# Altium schematic sheet EIS_Main_SensorInterface.SchDoc: Wirless-Power und Sensor-Schnittstellen
size A4; Organization: Hahn-Schickard; Address1: Wilhelm-Schickard-Str. 10; Address2: 78052 Villingen-Schwenningen; Address3: Bernd.Ehrbrecht@Hahn-Schickard.de; DocumentNumber: 1; Revision: 1.0; SheetNumber: 7; SheetTotal: 7; PhoneNumber: 0 7721 943 137; E-Mail: Xxxx.Xxxx@Hahn-Schickard.de; ProjectName: Project File Name
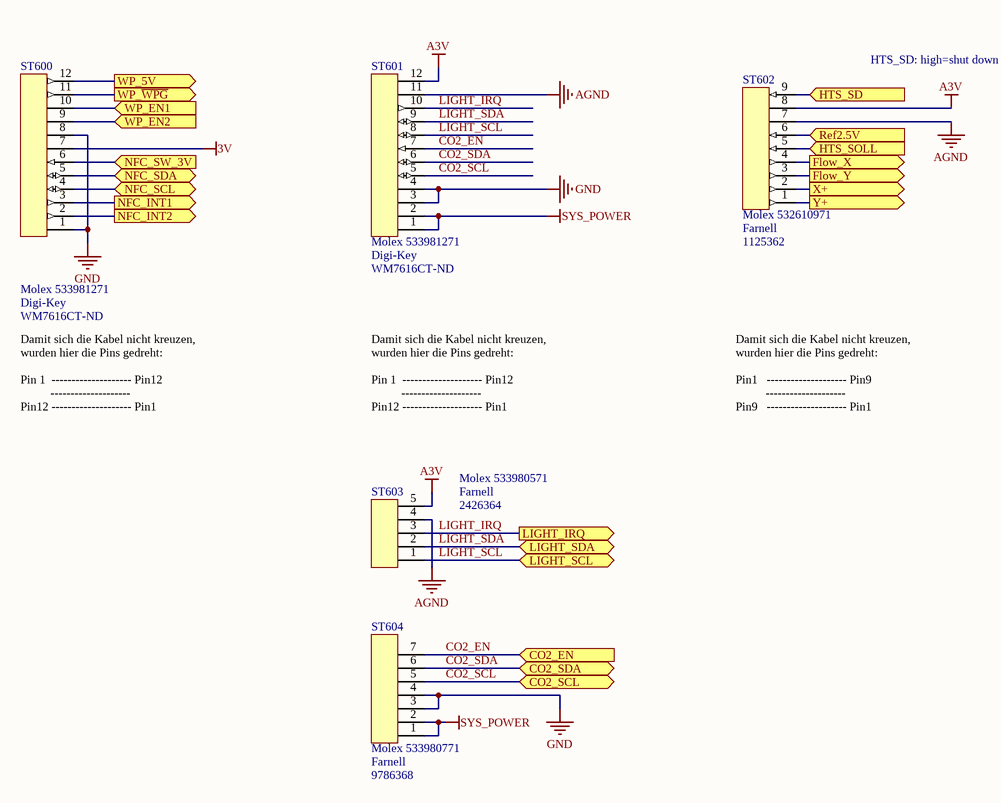
[diagram p0: EIS_Main_SensorInterface.SchDoc]

## Parts
ST600  Molex 533981271  Supplier 1: Digi-Key  Supplier Part Number 1: WM7616CT-ND  [Molex 533981271]
ST601  Molex 533981271  Supplier 1: Digi-Key  Supplier Part Number 1: WM7616CT-ND  [Molex 533981271]
ST602  Molex 532610971  Supplier 1: Farnell  Supplier Part Number 1: 1125362  [Molex 532610971]
ST603  Molex 533980571  Supplier 1: Farnell  Supplier Part Number 1: 2426364  [Molex 533980571]
ST604  Molex 533980771  Supplier 2: Farnell  Supplier Part Number 2: 9786368  [Molex 533980771]

## Ports
CO2_EN (in), CO2_SCL (bidir), CO2_SDA (bidir), Flow_X (out), Flow_Y (out), HTS_SD (in), HTS_SOLL (in), LIGHT_IRQ (out), LIGHT_SCL (bidir), LIGHT_SDA (bidir), NFC_INT1 (out), NFC_INT2 (out), NFC_SCL (bidir), NFC_SDA (bidir), NFC_SW_3V (in), Ref2.5V (in), WP_5V (out), WP_EN1 (in), WP_EN2 (in), WP_~{WPG} (out), X+ (out), Y+ (out)

## Nets
3V: ST600.7
A3V: ST601.12 ST602.8 ST603.5
AGND: ST601.11 ST602.7 ST603.4
GND: ST600.1 ST600.8 ST601.3 ST601.4 ST604.3 ST604.4
SYS_POWER: ST601.1 ST601.2 ST604.1 ST604.2
CO2_EN: ST601.7 ST604.7 ; port CO2_EN
CO2_SCL: ST601.5 ST604.5 ; port CO2_SCL
CO2_SDA: ST601.6 ST604.6 ; port CO2_SDA
Flow_X: ST602.4 ; port Flow_X
Flow_Y: ST602.3 ; port Flow_Y
HTS_SD: ST602.9 ; port HTS_SD
HTS_SOLL: ST602.5 ; port HTS_SOLL
LIGHT_IRQ: ST601.10 ST603.3 ; port LIGHT_IRQ
LIGHT_SCL: ST601.8 ST603.1 ; port LIGHT_SCL
LIGHT_SDA: ST601.9 ST603.2 ; port LIGHT_SDA
NFC_INT1: ST600.3 ; port NFC_INT1
NFC_INT2: ST600.2 ; port NFC_INT2
NFC_SCL: ST600.4 ; port NFC_SCL
NFC_SDA: ST600.5 ; port NFC_SDA
NFC_SW_3V: ST600.6 ; port NFC_SW_3V
Ref2.5V: ST602.6 ; port Ref2.5V
WP_5V: ST600.12 ; port WP_5V
WP_EN1: ST600.10 ; port WP_EN1
WP_EN2: ST600.9 ; port WP_EN2
WP_~{WPG}: ST600.11 ; port WP_~{WPG}
X+: ST602.2 ; port X+
Y+: ST602.1 ; port Y+

Not connected (* = marked no-connect by the designer): ST600 13 14; ST601 13 14; ST603 6 7; ST604 8 9

## Notes on the sheet
- (near ST602) HTS_SD: high=shut down
- Damit sich die Kabel nicht kreuzen, wurden hier die Pins gedreht:
  Pin 1  -------------------- Pin12
  --------------------
  Pin12 -------------------- Pin1
- Damit sich die Kabel nicht kreuzen, wurden hier die Pins gedreht:
  Pin1   -------------------- Pin9
  --------------------
  Pin9   -------------------- Pin1
- Project Name:
- Size:
- Date:
- Title:
- A4
- Time:
- Revision:
- Sheet
- of
- File:

## Library data of the parts
ST600 ST601 = Molex 533981271: Molex Pico 12Pol Blade SMD gerade 533980871; 07_Lieferant: Digi-Key; 08_Lieferanten_Nummer: WM7616CT-ND
ST602 = Molex 532610971: Stecker 9Pol universal; 07_Lieferant: Farnell; 08_Lieferanten_Nummer: 1125362
ST603 = Molex 533980571: MOLEX - 53398-0571 - STIFTLEISTE, SMT, 1.25MM, 5POL; 08_Lieferanten_Nummer: 1125354; 07_Lieferant: Farnell
ST604 = Molex 533980771: Molex Pico 7Pol Blade SMD gerade 533980771; Supplier 1: Farnell; 07_Lieferant: Farnell; 08_Lieferanten_Nummer: 9786368